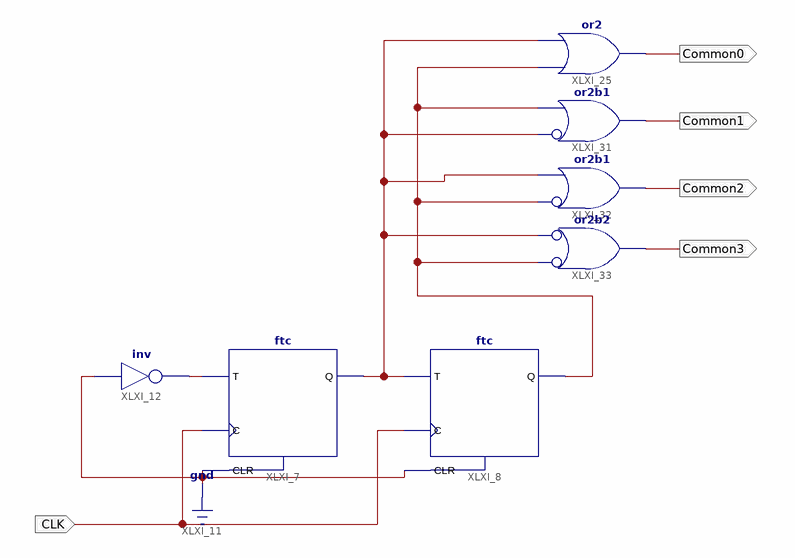
[diagram p0: schematic sheet 1]
// Xilinx ISE schematic comm_out.sch (spartan6) as structural Verilog: 7 symbols, 5 ports
module comm_out (
  input  CLK,
  output Common3,
  output Common2,
  output Common1,
  output Common0
);

  wire XLXN_23, XLXN_34, XLXN_37;

  ftc XLXI_8 (.C(CLK), .CLR(1'b0), .T(XLXN_37), .Q(XLXN_34));
  ftc XLXI_7 (.C(CLK), .CLR(1'b0), .T(XLXN_23), .Q(XLXN_37));
  not XLXI_12 (XLXN_23, 1'b0);
  or XLXI_25 (Common0, XLXN_34, XLXN_37);
  or XLXI_31 (Common1, ~XLXN_37, XLXN_34);  // or2b1
  or XLXI_32 (Common2, ~XLXN_34, XLXN_37);  // or2b1
  or XLXI_33 (Common3, ~XLXN_34, ~XLXN_37);  // or2b2
endmodule
